# Altium schematic sheet ADC_SCH.SchDoc
size A
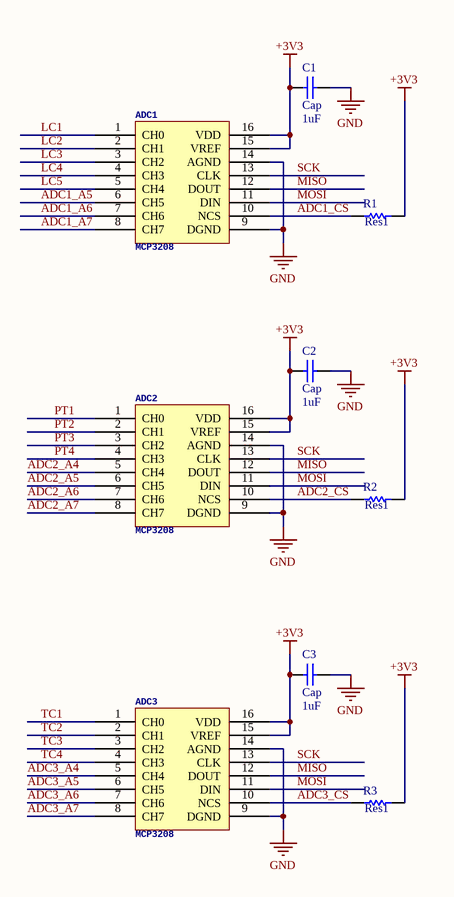
[diagram p0: ADC_SCH.SchDoc]

## Parts
ADC1  MCP3208
ADC2  MCP3208
ADC3  MCP3208
C1  Cap  value 1uF  [CAPCP2012X06N]
C2  Cap  value 1uF  [CAPCP2012X06N]
C3  Cap  value 1uF  [CAPCP2012X06N]
R1  Res1  [RESC_0805_2012]
R2  Res1  [RESC_0805_2012]
R3  Res1  [RESC_0805_2012]

## Nets
+3V3: ADC1.15(VREF) ADC1.16(VDD) ADC2.15(VREF) ADC2.16(VDD) ADC3.15(VREF) ADC3.16(VDD) C1.1 C2.1 C3.1 R1.2 R2.2 R3.2
GND: ADC1.9(DGND) ADC1.14(AGND) ADC2.9(DGND) ADC2.14(AGND) ADC3.9(DGND) ADC3.14(AGND) C1.2 C2.2 C3.2
ADC1_A5: ADC1.6(CH5)
ADC1_A6: ADC1.7(CH6)
ADC1_A7: ADC1.8(CH7)
ADC1_CS: ADC1.10(NCS) R1.1
ADC2_A4: ADC2.5(CH4)
ADC2_A5: ADC2.6(CH5)
ADC2_A6: ADC2.7(CH6)
ADC2_A7: ADC2.8(CH7)
ADC2_CS: ADC2.10(NCS) R2.1
ADC3_A4: ADC3.5(CH4)
ADC3_A5: ADC3.6(CH5)
ADC3_A6: ADC3.7(CH6)
ADC3_A7: ADC3.8(CH7)
ADC3_CS: ADC3.10(NCS) R3.1
LC1: ADC1.1(CH0)
LC2: ADC1.2(CH1)
LC3: ADC1.3(CH2)
LC4: ADC1.4(CH3)
LC5: ADC1.5(CH4)
MISO: ADC1.12(DOUT) ADC2.12(DOUT) ADC3.12(DOUT)
MOSI: ADC1.11(DIN) ADC2.11(DIN) ADC3.11(DIN)
PT1: ADC2.1(CH0)
PT2: ADC2.2(CH1)
PT3: ADC2.3(CH2)
PT4: ADC2.4(CH3)
SCK: ADC1.13(CLK) ADC2.13(CLK) ADC3.13(CLK)
TC1: ADC3.1(CH0)
TC2: ADC3.2(CH1)
TC3: ADC3.3(CH2)
TC4: ADC3.4(CH3)

## Library data of the parts
C1-C3 = Cap: Capacitor; Published: 8-Jun-2000; LatestRevisionDate: 17-Jul-2002; LatestRevisionNote: Re-released for DXP Platform.; PackageReference: RAD-0.3; Publisher: Altium Limited; PackageDescription: Radial Cap, Thru-Hole; 2 Leads; 0.3 in Pin Spacing
R1-R3 = Res1: Resistor; Published: 8-Jun-2000; LatestRevisionDate: 17-Jul-2002; LatestRevisionNote: Re-released for DXP Platform.; PackageReference: AXIAL-0.3; Publisher: Altium Limited; PackageDescription: Axial Device, Thru-Hole; 2 Leads; 0.3 in Pin Spacing